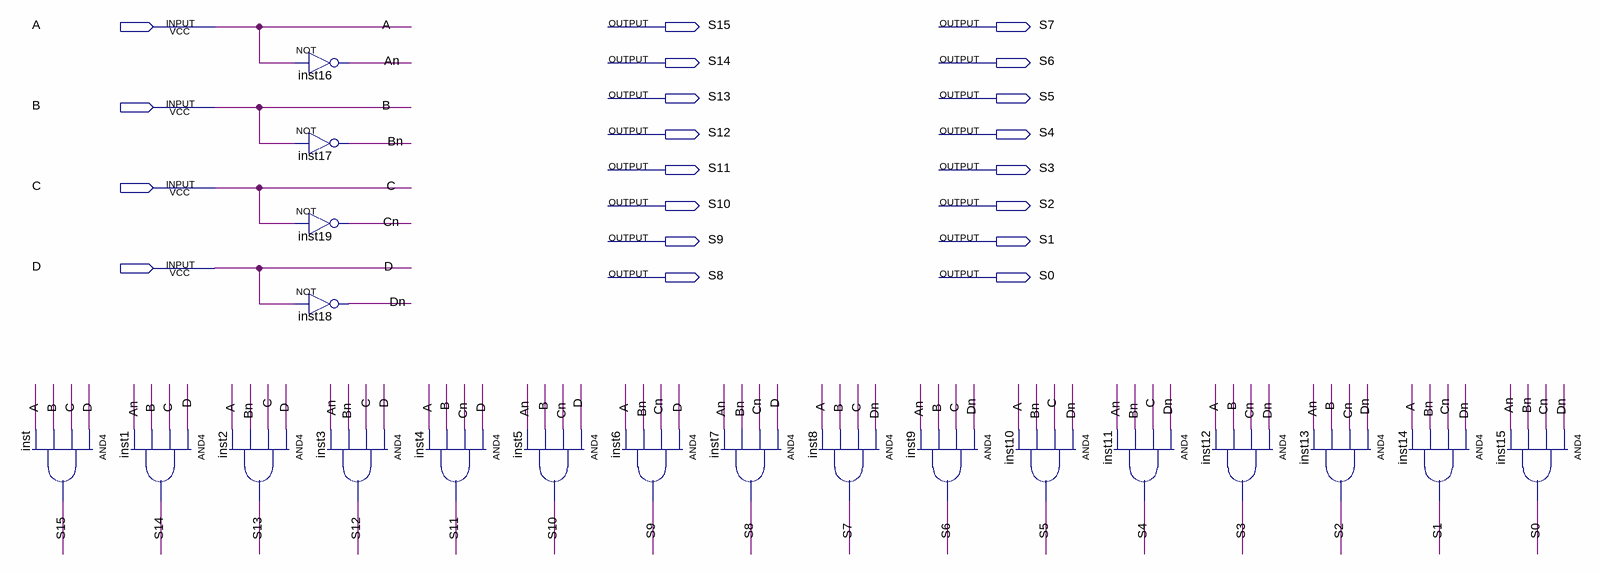
[diagram p0: schematic sheet]
// Quartus schematic decod4x16.bdf as structural Verilog: 20 symbols, 20 pins
module decod4x16 (
  input  A,
  input  B,
  input  C,
  input  D,
  output S15,
  output S7,
  output S14,
  output S6,
  output S13,
  output S5,
  output S12,
  output S4,
  output S11,
  output S3,
  output S10,
  output S2,
  output S9,
  output S1,
  output S8,
  output S0
);

  wire An, Bn, Cn, Dn;

  and inst (S15, D, C, B, A);
  and inst1 (S14, D, C, B, An);
  and inst2 (S13, D, C, Bn, A);
  not inst16 (An, A);
  not inst17 (Bn, B);
  not inst19 (Cn, C);
  not inst18 (Dn, D);
  and inst3 (S12, D, C, Bn, An);
  and inst4 (S11, D, Cn, B, A);
  and inst5 (S10, D, Cn, B, An);
  and inst6 (S9, D, Cn, Bn, A);
  and inst7 (S8, D, Cn, Bn, An);
  and inst8 (S7, Dn, C, B, A);
  and inst9 (S6, Dn, C, B, An);
  and inst10 (S5, Dn, C, Bn, A);
  and inst11 (S4, Dn, C, Bn, An);
  and inst12 (S3, Dn, Cn, B, A);
  and inst13 (S2, Dn, Cn, B, An);
  and inst14 (S1, Dn, Cn, Bn, A);
  and inst15 (S0, Dn, Cn, Bn, An);
endmodule
